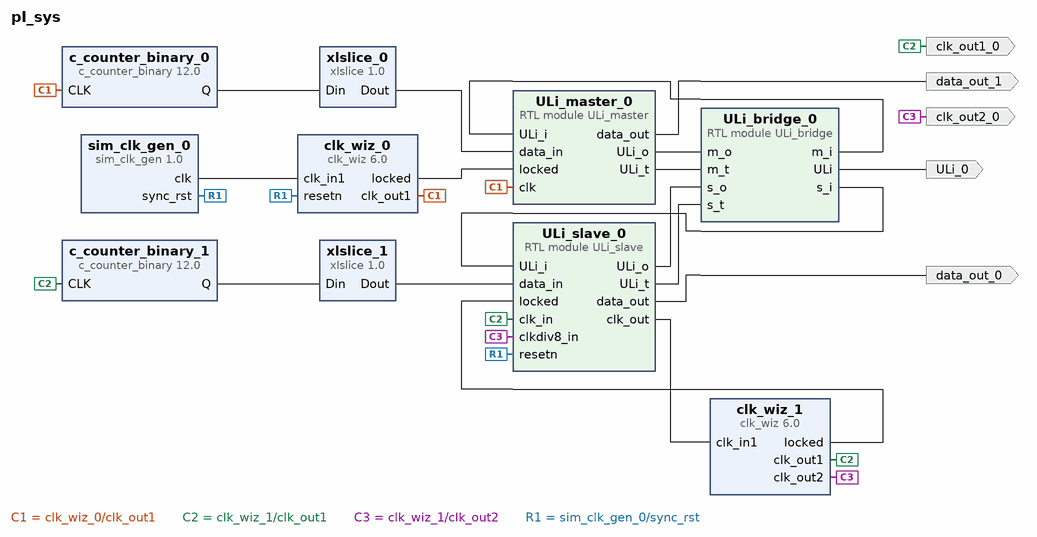
[diagram p0: block diagram of the top level]
# Vivado block design pl_sys, xc7s25ftgb196-1, Vivado 2025.2
create_bd_design pl_sys

create_bd_port -dir O -type clk clk_out1_0
create_bd_port -dir O -type clk clk_out2_0
create_bd_port -dir O data_out_0
create_bd_port -dir O ULi_0
create_bd_port -dir O data_out_1

create_bd_cell -type ip -vlnv xilinx.com:ip:sim_clk_gen:1.0 sim_clk_gen_0
set_property -dict {CONFIG.FREQ_HZ 10000000 CONFIG.INITIAL_RESET_CLOCK_CYCLES 16} [get_bd_cells sim_clk_gen_0]
create_bd_cell -type ip -vlnv xilinx.com:ip:clk_wiz:6.0 clk_wiz_0
set_property -dict [list \
  CONFIG.CLKIN1_JITTER_PS 1000.0 \
  CONFIG.CLKOUT1_JITTER 608.681 \
  CONFIG.CLKOUT1_PHASE_ERROR 919.522 \
  CONFIG.CLKOUT1_REQUESTED_OUT_FREQ 160.000 \
  CONFIG.MMCM_CLKFBOUT_MULT_F 64.000 \
  CONFIG.MMCM_CLKIN1_PERIOD 100.000 \
  CONFIG.MMCM_CLKIN2_PERIOD 10.0 \
  CONFIG.MMCM_CLKOUT0_DIVIDE_F 4.000 \
  CONFIG.PRIM_IN_FREQ 10.000 \
  CONFIG.RESET_PORT resetn \
  CONFIG.RESET_TYPE ACTIVE_LOW \
] [get_bd_cells clk_wiz_0]
create_bd_cell -type module -reference ULi_master ULi_master_0
create_bd_cell -type ip -vlnv xilinx.com:ip:c_counter_binary:12.0 c_counter_binary_0
create_bd_cell -type ip -vlnv xilinx.com:ip:xlslice:1.0 xlslice_0
set_property -dict {CONFIG.DIN_FROM 4 CONFIG.DIN_TO 4 CONFIG.DIN_WIDTH 16} [get_bd_cells xlslice_0]
create_bd_cell -type ip -vlnv xilinx.com:ip:clk_wiz:6.0 clk_wiz_1
set_property -dict [list \
  CONFIG.CLKIN1_JITTER_PS 1000.0 \
  CONFIG.CLKOUT1_JITTER 608.681 \
  CONFIG.CLKOUT1_PHASE_ERROR 919.522 \
  CONFIG.CLKOUT1_REQUESTED_OUT_FREQ 160.000 \
  CONFIG.CLKOUT1_REQUESTED_PHASE 0.000 \
  CONFIG.CLKOUT2_JITTER 827.152 \
  CONFIG.CLKOUT2_PHASE_ERROR 919.522 \
  CONFIG.CLKOUT2_REQUESTED_OUT_FREQ 20.000 \
  CONFIG.CLKOUT2_USED true \
  CONFIG.MMCM_CLKFBOUT_MULT_F 64.000 \
  CONFIG.MMCM_CLKIN1_PERIOD 100.000 \
  CONFIG.MMCM_CLKIN2_PERIOD 10.0 \
  CONFIG.MMCM_CLKOUT0_DIVIDE_F 4.000 \
  CONFIG.MMCM_CLKOUT0_PHASE 0.000 \
  CONFIG.MMCM_CLKOUT1_DIVIDE 32 \
  CONFIG.MMCM_DIVCLK_DIVIDE 1 \
  CONFIG.NUM_OUT_CLKS 2 \
  CONFIG.PRIM_IN_FREQ 10.000 \
  CONFIG.USE_RESET false \
] [get_bd_cells clk_wiz_1]
create_bd_cell -type module -reference ULi_slave ULi_slave_0
create_bd_cell -type module -reference ULi_bridge ULi_bridge_0
create_bd_cell -type ip -vlnv xilinx.com:ip:xlslice:1.0 xlslice_1
set_property -dict {CONFIG.DIN_TO 3 CONFIG.DIN_WIDTH 16} [get_bd_cells xlslice_1]
create_bd_cell -type ip -vlnv xilinx.com:ip:c_counter_binary:12.0 c_counter_binary_1

# ---- connections ----

connect_bd_net [get_bd_pins ULi_bridge_0/ULi] [get_bd_ports ULi_0]
connect_bd_net [get_bd_pins ULi_bridge_0/m_i] [get_bd_pins ULi_master_0/ULi_i]
connect_bd_net [get_bd_pins ULi_bridge_0/s_i] [get_bd_pins ULi_slave_0/ULi_i]
connect_bd_net [get_bd_pins ULi_master_0/ULi_o] [get_bd_pins ULi_bridge_0/m_o]
connect_bd_net [get_bd_pins ULi_master_0/ULi_t] [get_bd_pins ULi_bridge_0/m_t]
connect_bd_net [get_bd_pins ULi_master_0/data_out] [get_bd_ports data_out_1]
connect_bd_net [get_bd_pins ULi_slave_0/ULi_o] [get_bd_pins ULi_bridge_0/s_o]
connect_bd_net [get_bd_pins ULi_slave_0/ULi_t] [get_bd_pins ULi_bridge_0/s_t]
connect_bd_net [get_bd_pins ULi_slave_0/clk_out] [get_bd_pins clk_wiz_1/clk_in1]
connect_bd_net [get_bd_pins ULi_slave_0/data_out] [get_bd_ports data_out_0]
connect_bd_net [get_bd_pins c_counter_binary_0/Q] [get_bd_pins xlslice_0/Din]
connect_bd_net [get_bd_pins c_counter_binary_1/Q] [get_bd_pins xlslice_1/Din]
connect_bd_net [get_bd_pins clk_wiz_0/clk_out1] [get_bd_pins c_counter_binary_0/CLK] [get_bd_pins ULi_master_0/clk]
connect_bd_net [get_bd_pins clk_wiz_0/locked] [get_bd_pins ULi_master_0/locked]
connect_bd_net [get_bd_pins clk_wiz_1/clk_out1] [get_bd_ports clk_out1_0] [get_bd_pins c_counter_binary_1/CLK] [get_bd_pins ULi_slave_0/clk_in]
connect_bd_net [get_bd_pins clk_wiz_1/clk_out2] [get_bd_ports clk_out2_0] [get_bd_pins ULi_slave_0/clkdiv8_in]
connect_bd_net [get_bd_pins clk_wiz_1/locked] [get_bd_pins ULi_slave_0/locked]
connect_bd_net [get_bd_pins sim_clk_gen_0/clk] [get_bd_pins clk_wiz_0/clk_in1]
connect_bd_net [get_bd_pins sim_clk_gen_0/sync_rst] [get_bd_pins clk_wiz_0/resetn] [get_bd_pins ULi_slave_0/resetn]
connect_bd_net [get_bd_pins xlslice_0/Dout] [get_bd_pins ULi_master_0/data_in]
connect_bd_net [get_bd_pins xlslice_1/Dout] [get_bd_pins ULi_slave_0/data_in]

validate_bd_design
save_bd_design
